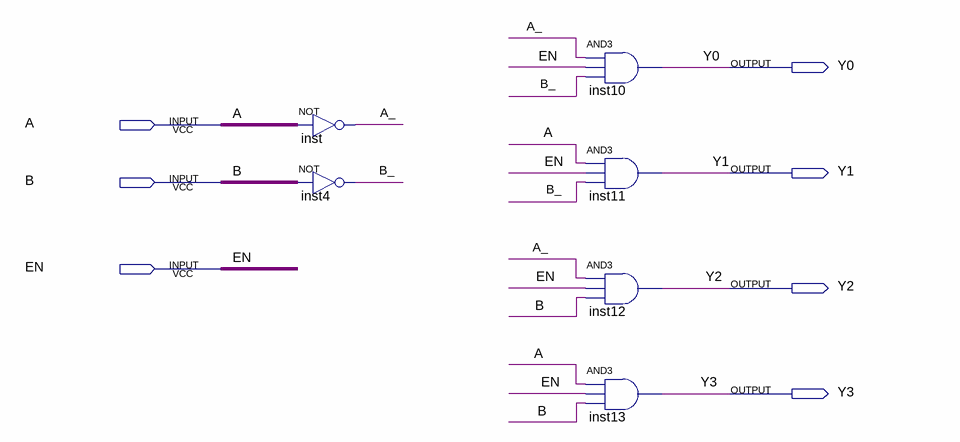
[diagram p0: schematic sheet]
// Quartus schematic Decoder_2_to_4.bdf as structural Verilog: 6 symbols, 7 pins
module Decoder_2_to_4 (
  input  A,
  input  B,
  input  EN,
  output Y0,
  output Y1,
  output Y2,
  output Y3
);

  wire A_, B_;

  not inst (A_, A);
  not inst4 (B_, B);
  and inst10 (Y0, A_, EN, B_);
  and inst11 (Y1, A, EN, B_);
  and inst12 (Y2, A_, EN, B);
  and inst13 (Y3, A, EN, B);
endmodule
